# EasyEDA schematic SCH_Assignment_PCB_2025-04-12.json
TITLE: Sheet_1; REV: 1.0; Date: 2025-04-07; Sheet: 1/1; Drawn By: Divyansh Maurya; Company: MMMUT
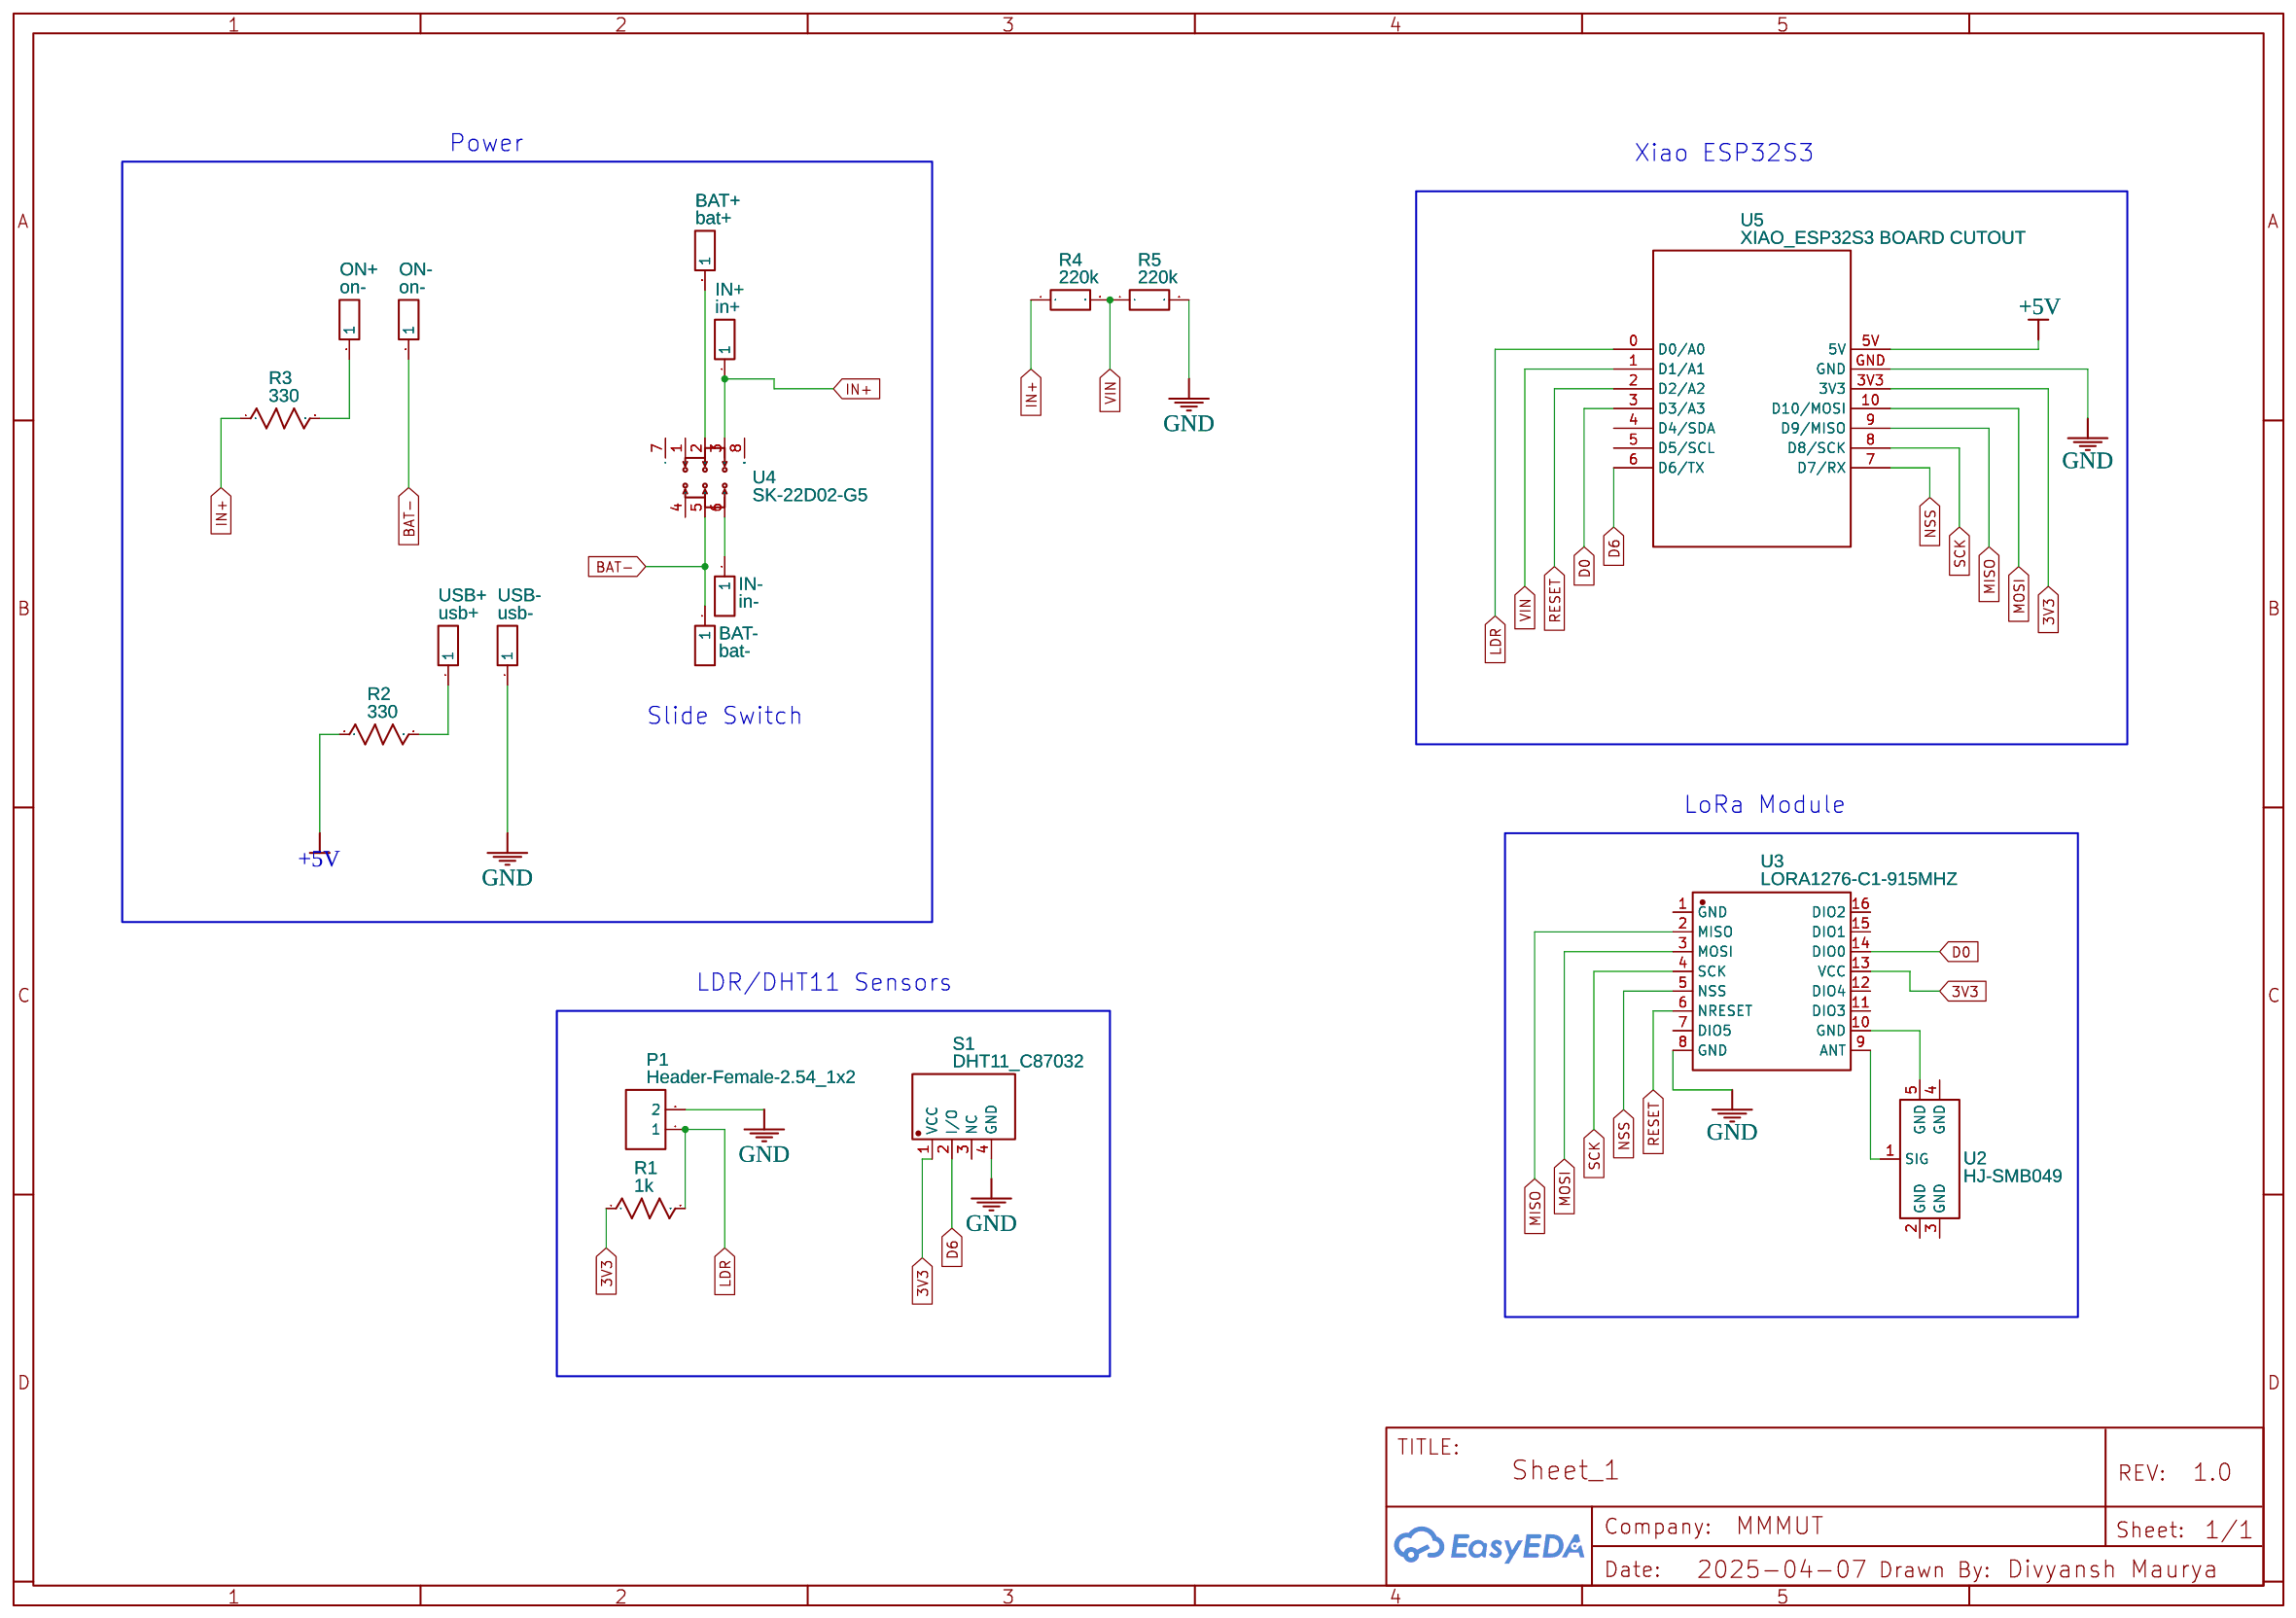
[diagram p0: schematic sheet]

## Parts
BAT+  bat+  [HDR-M-2.54_1X1]
BAT-  bat-  [HDR-M-2.54_1X1]
IN+  in+  [HDR-M-2.54_1X1]
IN-  in-  [HDR-M-2.54_1X1]
ON+  on-  [HDR-M-2.54_1X1]
ON-  on-  [HDR-M-2.54_1X1]
P1  Header-Female-2.54_1x2  [HDR-TH_2P-P2.54-V-F]
R1  1k  [R0603]
R2  330  [R0603]
R3  330  [R0603]
R4  220k  [R0603]
R5  220k  [R0603]
S1  DHT11_C87032  [SENSOR-TH_DHT11-1]
U2  HJ-SMB049  [SMA-TH_HJ-SMA015]
U3  LORA1276-C1-915MHZ  [COMM-SMD_LORA1276-C1-915MHZ]
U4  SK-22D02-G5  [SW-TH_DEALON_SK-22D02-G5]
U5  XIAO_ESP32S3 BOARD CUTOUT  [XIAO-ESP32S3-BOARD-CUTOUT]
USB+  usb+  [HDR-M-2.54_1X1]
USB-  usb-  [HDR-M-2.54_1X1]

## Library data of the parts
BAT+ BAT- IN+ IN- ON+ ON- USB+ USB- = HDR-M-2.54_1x1: Supplier Part: C81276; Supplier: LCSC; Contributor: LCEDA_Lib
P1 = Header-Female-2.54_1x2: Supplier: LCSC; Manufacturer: BOOMELE(博穆精密); Manufacturer Part: 2.54-1*2P母; Supplier Part: C49661; JLCPCB Part Class: Extended Part
R1-R3 = R_0603_US: Contributor: LCEDA_Lib
R4 R5 = R_0603_EU: Contributor: LCEDA_Lib
S1 = DHT11_C87032: Supplier Part: C87032; Supplier: LCSC; Manufacturer: AOSONG; Manufacturer Part: DHT11; JLCPCB Part Class: Extended Part
U2 = HJ-SMB049: Supplier: LCSC; Supplier Part: C6321925; Manufacturer: 皇捷; Contributor: lcsc; JLCPCB Part Class: Extended Part
U3 = LORA1276-C1-915MHZ: Contributor: lcsc; Supplier: LCSC; Supplier Part: C3001531; Manufacturer: G-NiceRF(思为无线); Manufacturer Part: lora1276-C1-915MHz; JLCPCB Part Class: Extended Part
U4 = SK-22D02-G5: Contributor: lcsc; Supplier: LCSC; Supplier Part: C7424918; Manufacturer: DEALON(德艺隆); JLCPCB Part Class: Extended Part
U5 = XIAO_ESP32S3 BOARD CUTOUT: Manufacturer: SeeedStudio; Manufacturer Part: XIAO ESP32C3; Supplier Part: 1597-113991054-ND; Supplier: Digi-Key; link: https://wiki.seeedstudio.com/XIAO_ESP32C3_Getting_Started/; Contributor: Carsen Klock

## Nets
3V3: R1.1 S1.1(VCC) U3.13(VCC) U5.3V3
+5V: R2.1 U5.5V
GND: P1.2 R5.2 S1.4(GND) U3.8(GND) U5.GND USB-.1
VIN: R4.2 R5.1 U5.1(D1/A1)
BAT-: BAT-.1 ON-.1 U4.5
D0: U3.14(DIO0) U5.3(D3/A3)
D6: S1.2(I/O) U5.6(D6/TX)
IN+: IN+.1 R3.1 R4.1 U4.3
LDR: P1.1 R1.2 U5.0(D0/A0)
MISO: U3.2(MISO) U5.9(D9/MISO)
MOSI: U3.3(MOSI) U5.10(D10/MOSI)
NSS: U3.5(NSS) U5.7(D7/RX)
RESET: U3.6(NRESET) U5.2(D2/A2)
SCK: U3.4(SCK) U5.8(D8/SCK)
Net-(BAT+-1): BAT+.1 U4.2
Net-(IN--1): IN-.1 U4.6
Net-(ON+-1): ON+.1 R3.2
Net-(R2-2): R2.2 USB+.1
Net-(U2-1): U2.1(SIG) U3.9(ANT)
Net-(U2-5): U2.5(GND) U3.10(GND)

Not connected (* = marked no-connect by the designer): S1 3(NC); U2 2(GND) 3(GND) 4(GND); U3 1(GND) 7(DIO5) 11(DIO3) 12(DIO4) 15(DIO1) 16(DIO2); U4 1 4 7 8; U5 4(D4/SDA) 5(D5/SCL)

## Notes on the sheet
- Power
- Xiao ESP32S3
- Slide Switch
- LoRa Module
- LDR/DHT11 Sensors
